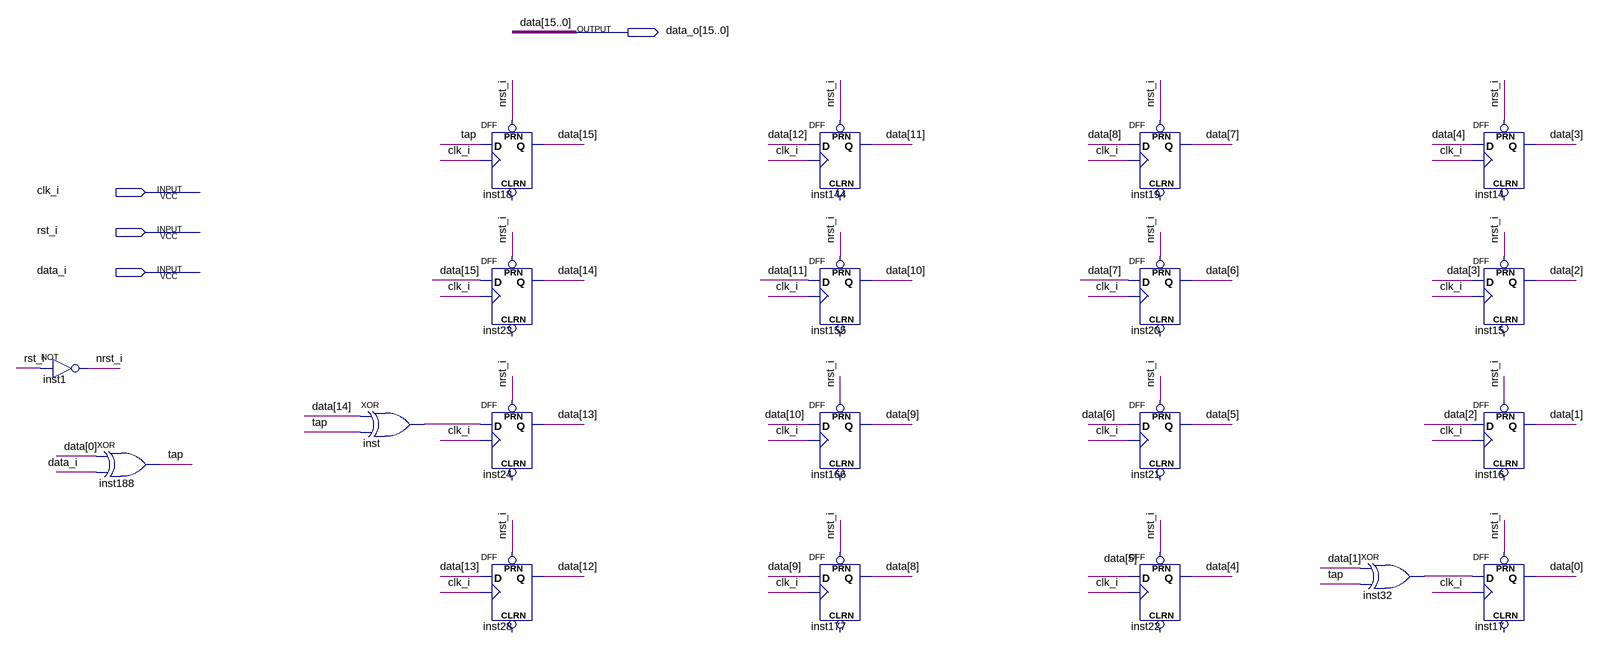
[diagram p0: schematic sheet]
// Quartus schematic crc_16_ansi.bdf as structural Verilog: 20 symbols, 4 pins
module crc_16_ansi (
  input  clk_i,
  input  rst_i,
  input  data_i,
  output [15:0] data_o
);

  wire inst32_out, inst_out, nrst_i, tap;

  not inst1 (nrst_i, rst_i);
  xor inst188 (tap, data_o[0], data_i);
  xor inst (inst_out, data_o[14], tap);
  DFF inst18 (.CLK(clk_i), .D(tap), .PRN(nrst_i), .Q(data_o[15]));  // open: CLRN
  DFF inst23 (.CLK(clk_i), .D(data_o[15]), .PRN(nrst_i), .Q(data_o[14]));  // open: CLRN
  DFF inst24 (.CLK(clk_i), .D(inst_out), .PRN(nrst_i), .Q(data_o[13]));  // open: CLRN
  DFF inst28 (.CLK(clk_i), .D(data_o[13]), .PRN(nrst_i), .Q(data_o[12]));  // open: CLRN
  DFF inst144 (.CLK(clk_i), .D(data_o[12]), .PRN(nrst_i), .Q(data_o[11]));  // open: CLRN
  DFF inst155 (.CLK(clk_i), .D(data_o[11]), .PRN(nrst_i), .Q(data_o[10]));  // open: CLRN
  DFF inst166 (.CLK(clk_i), .D(data_o[10]), .PRN(nrst_i), .Q(data_o[9]));  // open: CLRN
  DFF inst177 (.CLK(clk_i), .D(data_o[9]), .PRN(nrst_i), .Q(data_o[8]));  // open: CLRN
  DFF inst19 (.CLK(clk_i), .D(data_o[8]), .PRN(nrst_i), .Q(data_o[7]));  // open: CLRN
  DFF inst20 (.CLK(clk_i), .D(data_o[7]), .PRN(nrst_i), .Q(data_o[6]));  // open: CLRN
  DFF inst21 (.CLK(clk_i), .D(data_o[6]), .PRN(nrst_i), .Q(data_o[5]));  // open: CLRN
  DFF inst22 (.CLK(clk_i), .D(data_o[5]), .PRN(nrst_i), .Q(data_o[4]));  // open: CLRN
  xor inst32 (inst32_out, data_o[1], tap);
  DFF inst14 (.CLK(clk_i), .D(data_o[4]), .PRN(nrst_i), .Q(data_o[3]));  // open: CLRN
  DFF inst15 (.CLK(clk_i), .D(data_o[3]), .PRN(nrst_i), .Q(data_o[2]));  // open: CLRN
  DFF inst16 (.CLK(clk_i), .D(data_o[2]), .PRN(nrst_i), .Q(data_o[1]));  // open: CLRN
  DFF inst17 (.CLK(clk_i), .D(inst32_out), .PRN(nrst_i), .Q(data_o[0]));  // open: CLRN

  // Other names for the same wires on the sheet: data[15:0] = data_o
endmodule
